# Altium schematic sheet Op-Amp Stage.SchDoc
size A
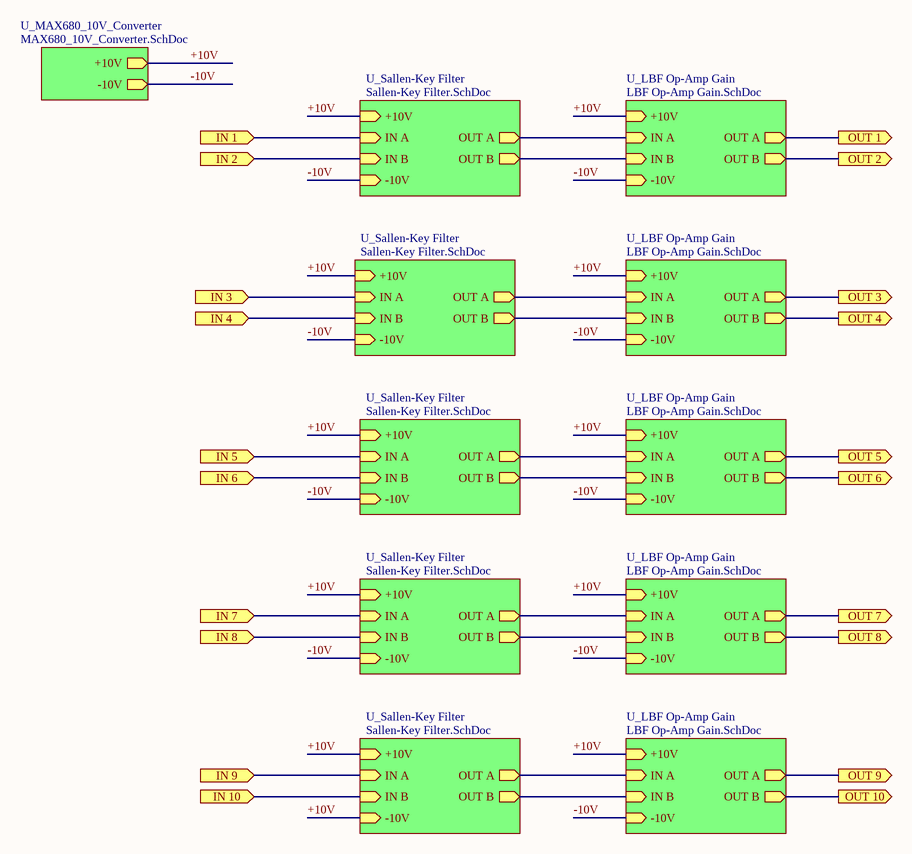
[diagram p0: Op-Amp Stage.SchDoc]

## Sub-sheets
U_LBF Op-Amp Gain = LBF Op-Amp Gain.SchDoc: IN A (in), IN B (in), OUT B (out), OUT A (out), +10V (in), -10V (in)
U_LBF Op-Amp Gain = LBF Op-Amp Gain.SchDoc: IN A (in), IN B (in), OUT B (out), OUT A (out), +10V (in), -10V (in)
U_LBF Op-Amp Gain = LBF Op-Amp Gain.SchDoc: IN A (in), IN B (in), OUT B (out), OUT A (out), +10V (in), -10V (in)
U_LBF Op-Amp Gain = LBF Op-Amp Gain.SchDoc: IN A (in), IN B (in), OUT B (out), OUT A (out), +10V (in), -10V (in)
U_LBF Op-Amp Gain = LBF Op-Amp Gain.SchDoc: IN A (in), IN B (in), OUT B (out), OUT A (out), +10V (in), -10V (in)
U_MAX680_10V_Converter = MAX680_10V_Converter.SchDoc: -10V (out), +10V (out)
U_Sallen-Key Filter = Sallen-Key Filter.SchDoc: IN A (in), OUT A (out), OUT B (out), IN B (in), +10V (in), -10V (in)
U_Sallen-Key Filter = Sallen-Key Filter.SchDoc: IN A (in), OUT A (out), OUT B (out), IN B (in), +10V (in), -10V (in)
U_Sallen-Key Filter = Sallen-Key Filter.SchDoc: IN A (in), OUT A (out), OUT B (out), IN B (in), +10V (in), -10V (in)
U_Sallen-Key Filter = Sallen-Key Filter.SchDoc: IN A (in), OUT A (out), OUT B (out), IN B (in), +10V (in), -10V (in)
U_Sallen-Key Filter = Sallen-Key Filter.SchDoc: IN A (in), OUT A (out), OUT B (out), IN B (in), +10V (in), -10V (in)

## Ports
IN 1 (in), IN 2 (in), IN 3 (in), IN 4 (in), IN 5 (in), IN 6 (in), IN 7 (in), IN 8 (in), IN 9 (in), IN 10 (in), OUT 1 (out), OUT 2 (out), OUT 3 (out), OUT 4 (out), OUT 5 (out), OUT 6 (out), OUT 7 (out), OUT 8 (out), OUT 9 (out), OUT 10 (out)

## Nets
+10V: sheet U_Sallen-Key Filter/+10V, sheet U_Sallen-Key Filter/+10V, sheet U_Sallen-Key Filter/+10V, sheet U_Sallen-Key Filter/+10V, sheet U_Sallen-Key Filter/+10V, sheet U_Sallen-Key Filter/-10V, sheet U_LBF Op-Amp Gain/+10V, sheet U_LBF Op-Amp Gain/+10V, sheet U_LBF Op-Amp Gain/+10V, sheet U_LBF Op-Amp Gain/+10V, sheet U_LBF Op-Amp Gain/+10V, sheet U_MAX680_10V_Converter/+10V
-10V: sheet U_Sallen-Key Filter/-10V, sheet U_Sallen-Key Filter/-10V, sheet U_Sallen-Key Filter/-10V, sheet U_Sallen-Key Filter/-10V, sheet U_LBF Op-Amp Gain/-10V, sheet U_LBF Op-Amp Gain/-10V, sheet U_LBF Op-Amp Gain/-10V, sheet U_LBF Op-Amp Gain/-10V, sheet U_LBF Op-Amp Gain/-10V, sheet U_MAX680_10V_Converter/-10V
IN 1: port IN 1, sheet U_Sallen-Key Filter/IN A
IN 2: port IN 2, sheet U_Sallen-Key Filter/IN B
IN 3: port IN 3, sheet U_Sallen-Key Filter/IN A
IN 4: port IN 4, sheet U_Sallen-Key Filter/IN B
IN 5: port IN 5, sheet U_Sallen-Key Filter/IN A
IN 6: port IN 6, sheet U_Sallen-Key Filter/IN B
IN 7: port IN 7, sheet U_Sallen-Key Filter/IN A
IN 8: port IN 8, sheet U_Sallen-Key Filter/IN B
IN 9: port IN 9, sheet U_Sallen-Key Filter/IN A
IN 10: port IN 10, sheet U_Sallen-Key Filter/IN B
OUT 1: port OUT 1, sheet U_LBF Op-Amp Gain/OUT A
OUT 2: port OUT 2, sheet U_LBF Op-Amp Gain/OUT B
OUT 3: port OUT 3, sheet U_LBF Op-Amp Gain/OUT A
OUT 4: port OUT 4, sheet U_LBF Op-Amp Gain/OUT B
OUT 5: port OUT 5, sheet U_LBF Op-Amp Gain/OUT A
OUT 6: port OUT 6, sheet U_LBF Op-Amp Gain/OUT B
OUT 7: port OUT 7, sheet U_LBF Op-Amp Gain/OUT A
OUT 8: port OUT 8, sheet U_LBF Op-Amp Gain/OUT B
OUT 9: port OUT 9, sheet U_LBF Op-Amp Gain/OUT A
OUT 10: port OUT 10, sheet U_LBF Op-Amp Gain/OUT B
(unnamed): sheet U_Sallen-Key Filter/OUT A, sheet U_LBF Op-Amp Gain/IN A
(unnamed): sheet U_Sallen-Key Filter/OUT B, sheet U_LBF Op-Amp Gain/IN B
(unnamed): sheet U_Sallen-Key Filter/OUT A, sheet U_LBF Op-Amp Gain/IN A
(unnamed): sheet U_Sallen-Key Filter/OUT B, sheet U_LBF Op-Amp Gain/IN B
(unnamed): sheet U_Sallen-Key Filter/OUT A, sheet U_LBF Op-Amp Gain/IN A
(unnamed): sheet U_Sallen-Key Filter/OUT B, sheet U_LBF Op-Amp Gain/IN B
(unnamed): sheet U_Sallen-Key Filter/OUT A, sheet U_LBF Op-Amp Gain/IN A
(unnamed): sheet U_Sallen-Key Filter/OUT B, sheet U_LBF Op-Amp Gain/IN B
(unnamed): sheet U_Sallen-Key Filter/OUT A, sheet U_LBF Op-Amp Gain/IN A
(unnamed): sheet U_Sallen-Key Filter/OUT B, sheet U_LBF Op-Amp Gain/IN B